# EasyEDA Pro project MSDRV4.eprj, schematic Schematic1
Board Name: Board1; Create Date: 2025-01-27; Page Name: P1; Project Name: MSDRV4; Schematic Name: Schematic1; Update Date: 2025-04-11; Company: EasyEDA.com; Page Size: A4; Version: V1.0
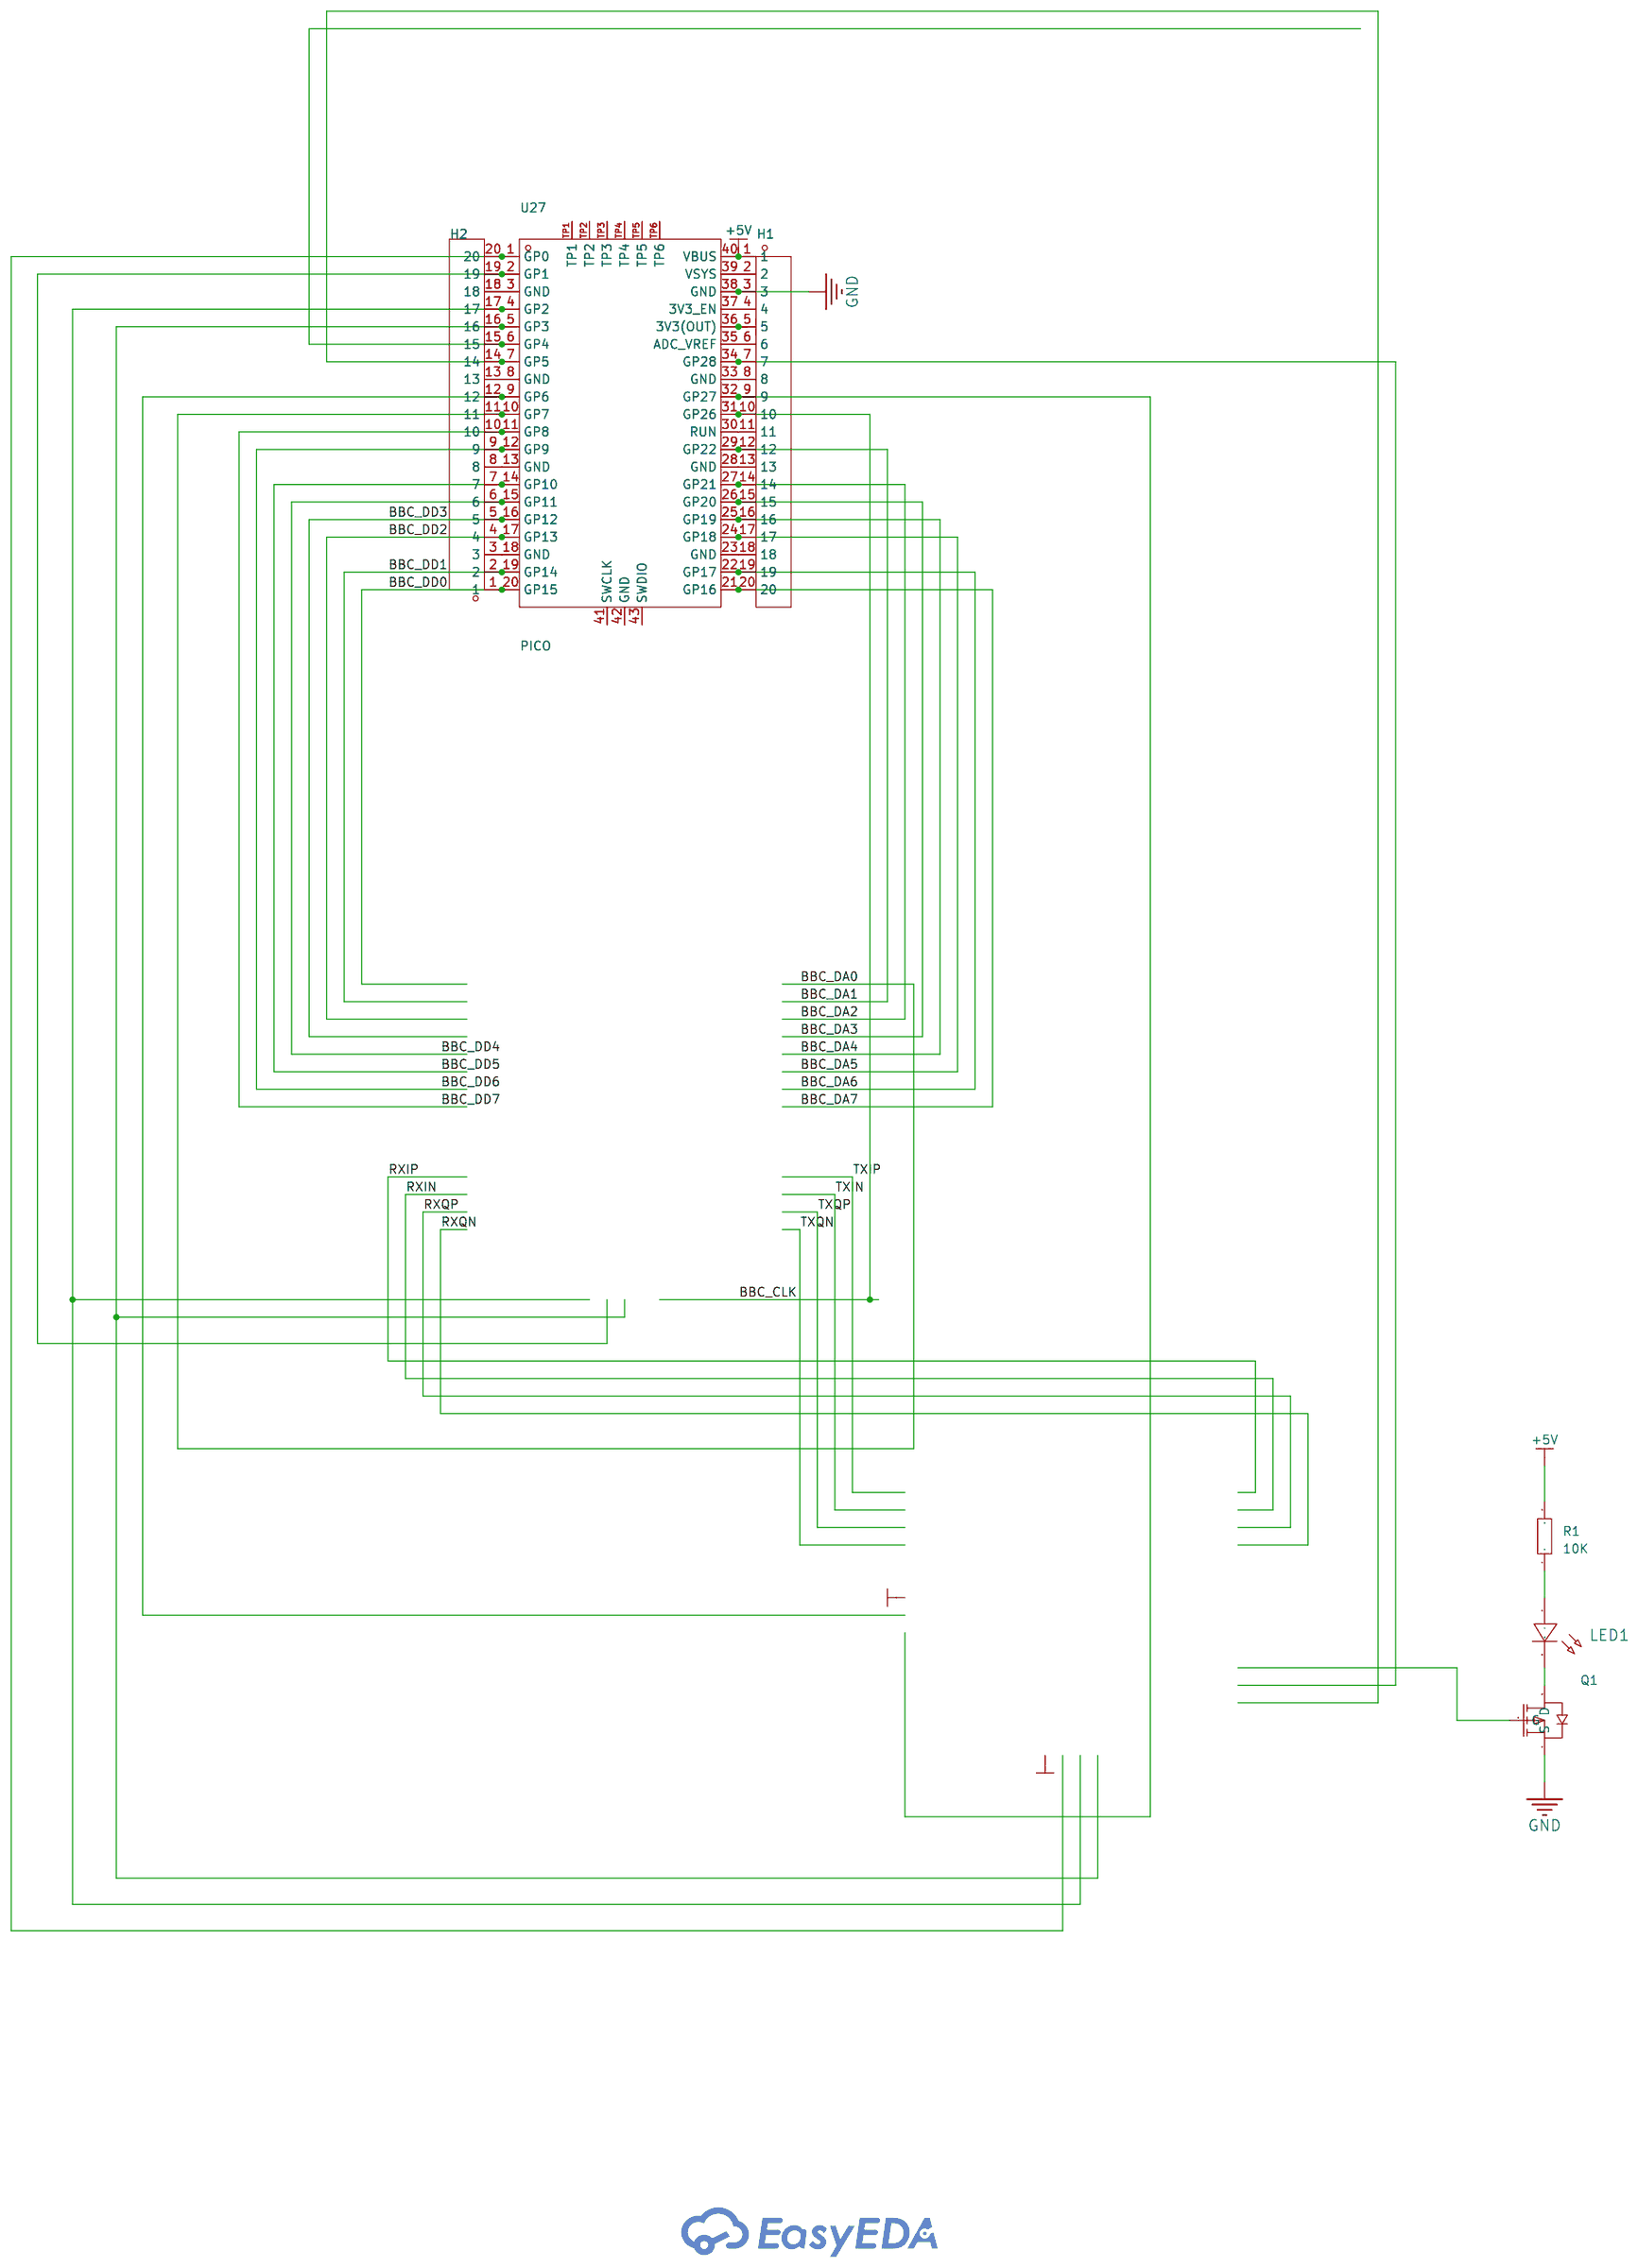
[diagram p0: schematic sheet]

## Parts
CBB1  -
CBB2  -
H1  -  [HDR-TH_20P-P2.54-V-M-1]
H2  -  [HDR-TH_20P-P2.54-V-M-1]
LED1  -  [LED0603-R-RD]
Q1  -  [SOT-23_L2.9-W1.3-P1.90-LS2.4-BR]
R1  10K  [R0603]
U27  PICO  [comm-smd_l51.0-w21.0-p2.54_sc0916]

## Library data of the parts
H1 H2 = HDR-M_2.54_1x20P: Supplier Footprint: Through
LED1 = LED_0603-R: Supplier Footprint: 0603
Q1 = P_MOS: Supplier Footprint: SOT-23-3L
R1 = Res_0603: Supplier Footprint: 0603
U27 = PICO: Supplier: LCSC; Supplier Part: C7203002; Manufacturer: Raspberry Pi(树莓派); JLCPCB Part Class: Extended Part; Datasheet: https://atta.szlcsc.com/upload/public/pdf/source/20230906/086376002DDC9866828648BC93E51F8B.pdf

## Nets
+5V: H1.1 R1.2 U27.40(VBUS)
GND: H1.3 Q1.2(S) U27.38(GND)
3.3: CBB1.(TXQN) CBB2.(REF) H1.5 H1.7 H1.9 H1.10 H1.12 H1.14 H1.15 H1.16 H1.17 H1.19 H1.20 H2.1 H2.2 H2.4 H2.5 H2.6 H2.7 H2.9 H2.10 H2.11 H2.12 H2.14 H2.16 H2.17 H2.19 H2.20 Q1.1(G) U27.1(GP0) U27.2(GP1) U27.4(GP2) U27.5(GP3) U27.7(GP5) U27.9(GP6) U27.10(GP7) U27.11(GP8) U27.12(GP9) U27.14(GP10) U27.15(GP11) U27.16(GP12) U27.17(GP13) U27.19(GP14) U27.20(GP15) U27.21(GP16) U27.22(GP17) U27.24(GP18) U27.25(GP19) U27.26(GP20) U27.27(GP21) U27.29(GP22) U27.31(GP26) U27.32(GP27) U27.34(GP28) U27.36(3V3(OUT))
$1N2356: H2.3 U27.18(GND)
$1N2366: H2.8 U27.13(GND)
$1N2372: H2.13 U27.8(GND)
$1N2374: H2.18 U27.3(GND)
$1N2378: H1.2 U27.39(VSYS)
$1N2382: H1.4 U27.37(3V3_EN)
$1N2386: H1.6 U27.35(ADC_VREF)
$1N2390: H1.8 U27.33(GND)
$1N2396: H1.11 U27.30(RUN)
$1N2400: H1.13 U27.28(GND)
$1N2410: H1.18 U27.23(GND)
$1N4497: H2.15 U27.6(GP4)
$1N4593: LED1.2(C) Q1.3(D)
$1N4646: LED1.1(A) R1.1

Not connected (* = marked no-connect by the designer): U27 41(SWCLK) 42(GND) 43(SWDIO) TP1 TP2 TP3 TP4 TP5 TP6
